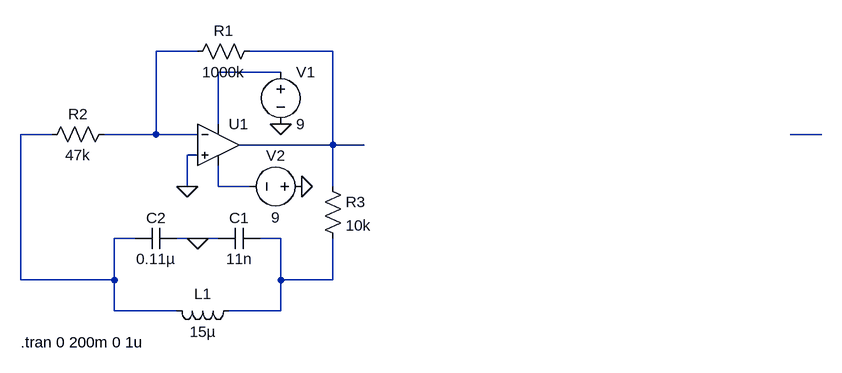
[diagram p0: schematic Colpitts.asc]
Colpitts.asc, the LTspice schematic file:
Version 4
SHEET 1 1140 680
WIRE 160 16 96 16
WIRE 368 16 240 16
WIRE 288 48 192 48
WIRE 192 128 192 48
WIRE -64 144 -112 144
WIRE 96 144 96 16
WIRE 96 144 16 144
WIRE 160 144 96 144
WIRE 1120 144 1072 144
WIRE 368 160 368 16
WIRE 368 160 224 160
WIRE 416 160 368 160
WIRE 160 176 144 176
WIRE 144 224 144 176
WIRE 192 224 192 192
WIRE 240 224 192 224
WIRE 368 224 368 160
WIRE 64 304 32 304
WIRE 160 304 128 304
WIRE 192 304 160 304
WIRE 288 304 256 304
WIRE -112 368 -112 144
WIRE 32 368 32 304
WIRE 32 368 -112 368
WIRE 288 368 288 304
WIRE 368 368 368 304
WIRE 368 368 288 368
WIRE 32 416 32 368
WIRE 128 416 32 416
WIRE 288 416 288 368
WIRE 288 416 208 416
FLAG 288 128 0
FLAG 160 304 0
FLAG 144 224 0
FLAG 320 224 0
SYMBOL OpAmps\\UniversalOpAmp2 192 160 R0
SYMATTR InstName U1
SYMBOL res 256 0 R90
WINDOW 0 0 56 VBottom 2
WINDOW 3 32 56 VTop 2
SYMATTR InstName R1
SYMATTR Value 1000k
SYMBOL res 32 128 R90
WINDOW 0 0 56 VBottom 2
WINDOW 3 32 56 VTop 2
SYMATTR InstName R2
SYMATTR Value 47k
SYMBOL cap 256 288 R90
WINDOW 0 0 32 VBottom 2
WINDOW 3 32 32 VTop 2
SYMATTR InstName C1
SYMATTR Value 11n
SYMBOL cap 128 288 R90
WINDOW 0 0 32 VBottom 2
WINDOW 3 32 32 VTop 2
SYMATTR InstName C2
SYMATTR Value 0.11µ
SYMBOL ind 224 400 R90
WINDOW 0 5 56 VBottom 2
WINDOW 3 32 56 VTop 2
SYMATTR InstName L1
SYMATTR Value 15µ
SYMATTR SpiceLine Rser=1u
SYMBOL voltage 288 32 R0
SYMATTR InstName V1
SYMATTR Value 9
SYMBOL res 352 208 R0
SYMATTR InstName R3
SYMATTR Value 10k
SYMBOL voltage 336 224 R90
WINDOW 0 -32 56 VBottom 2
WINDOW 3 32 56 VTop 2
SYMATTR InstName V2
SYMATTR Value 9
TEXT -112 464 Left 2 !.tran 0 200m 0 1u

The netlist it stands for:
* Colpitts.asc
XU1 0 N001 N003 N006 N002 level2 Avol=1Meg GBW=10Meg Slew=10Meg Ilimit=25m Rail=0 Vos=0 En=0 Enk=0 In=0 Ink=0 Rin=500Meg  ; pins In+ In- V+ V- OUT
R1 N002 N001 1000k
R2 N001 N004 47k
C1 N007 0 11n
C2 0 N004 0.11µ
L1 N007 N004 15µ Rser=1u
V1 N003 0 9
R3 N002 N007 10k
V2 0 N006 9
.tran 0 200m 0 1u
.lib UniversalOpAmp2.lib
.backanno
.end